# Altium schematic sheet MPPT.SchDoc
size 297 x 209 mm; SheetNumber: 6; SheetTotal: 9
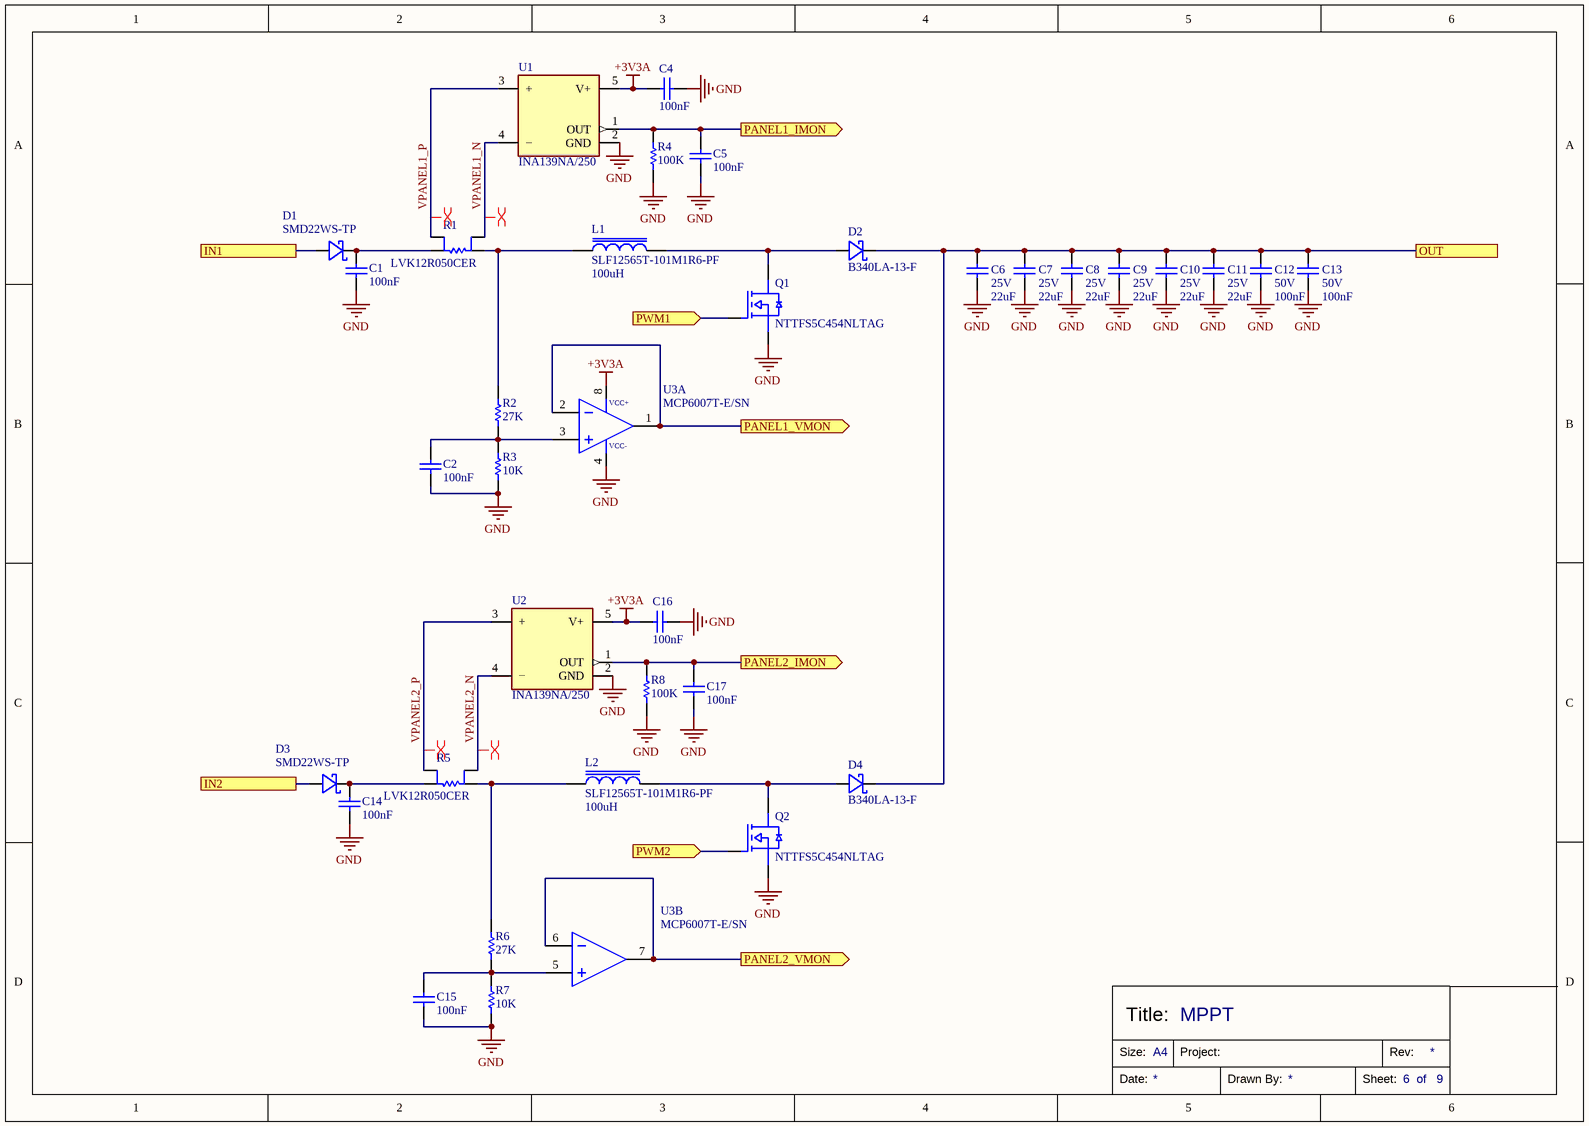
[diagram p0: MPPT.SchDoc]

## Parts
C1  Capacitance: 100nF  [CAPC0603X040]  (hidden comment: C0603C104K5RACTU)
C2  Capacitance: 100nF  [CAPC0603X040]  (hidden comment: C0603C104K5RACTU)
C4  Capacitance: 100nF  [CAPC0603X040]  (hidden comment: C0603C104K5RACTU)
C5  Capacitance: 100nF  [CAPC0603X040]  (hidden comment: C0603C104K5RACTU)
C6  Voltage Rating: 25V  Capacitance: 22uF  [CAPC1210X090]  (hidden comment: CL32B226KAJNNNE)
C7  Voltage Rating: 25V  Capacitance: 22uF  [CAPC1210X090]  (hidden comment: CL32B226KAJNNNE)
C8  Voltage Rating: 25V  Capacitance: 22uF  [CAPC1210X090]  (hidden comment: CL32B226KAJNNNE)
C9  Voltage Rating: 25V  Capacitance: 22uF  [CAPC1210X090]  (hidden comment: CL32B226KAJNNNE)
C10  Voltage Rating: 25V  Capacitance: 22uF  [CAPC1210X090]  (hidden comment: CL32B226KAJNNNE)
C11  Voltage Rating: 25V  Capacitance: 22uF  [CAPC1210X090]  (hidden comment: CL32B226KAJNNNE)
C12  Voltage Rating: 50V  Capacitance: 100nF  [CAPC0603X040]  (hidden comment: C0603C104K5RACTU)
C13  Voltage Rating: 50V  Capacitance: 100nF  [CAPC0603X040]  (hidden comment: C0603C104K5RACTU)
C14  Capacitance: 100nF  [CAPC0603X040]  (hidden comment: C0603C104K5RACTU)
C15  Capacitance: 100nF  [CAPC0603X040]  (hidden comment: C0603C104K5RACTU)
C16  Capacitance: 100nF  [CAPC0603X040]  (hidden comment: C0603C104K5RACTU)
C17  Capacitance: 100nF  [CAPC0603X040]  (hidden comment: C0603C104K5RACTU)
D1  SMD22WS-TP  [SOD-323]
D2  B340LA-13-F  [DO-214]
D3  SMD22WS-TP  [SOD-323]
D4  B340LA-13-F  [DO-214]
L1  SLF12565T-101M1R6-PF  Inductance: 100uH  [SLF12565T-101M1R6-PF]
L2  SLF12565T-101M1R6-PF  Inductance: 100uH  [SLF12565T-101M1R6-PF]
Q1  NTTFS5C454NLTAG  [NTTFS5C454NLTAG]
Q2  NTTFS5C454NLTAG  [NTTFS5C454NLTAG]
R1  LVK12R050CER  [LVK12R050CER-1]
R2  Resistance: 27K  [RESC0603]  (hidden comment: RMCF0603FT27K0)
R3  Resistance: 10K  [RESC0603]  (hidden comment: RMCF0603FT10K0)
R4  Resistance: 100K  [RESC0603]  (hidden comment: RMCF0603FT100K)
R5  LVK12R050CER  [LVK12R050CER-2]
R6  Resistance: 27K  [RESC0603]  (hidden comment: RMCF0603FT27K0)
R7  Resistance: 10K  [RESC0603]  (hidden comment: RMCF0603FT10K0)
R8  Resistance: 100K  [RESC0603]  (hidden comment: RMCF0603FT100K)
U1  INA139NA/250  [SOT23-5 IC]
U2  INA139NA/250  [SOT23-5 IC]
U3  MCP6007T-E/SN  [SOIC-8]  (parts A,B of 2)

## Ports
IN1 (see Power_Path[3C]), IN2 (see Power_Path[3C]), OUT (see Power_Path[3C], Charger[6B]), PANEL1_IMON (out, see Power_Path[3C], Controller[2B]), PANEL1_VMON (out, see Power_Path[3C], Controller[2B]), PANEL2_IMON (out, see Power_Path[3C], Controller[2B]), PANEL2_VMON (out, see Power_Path[3C], Controller[2B]), PWM1 (in, see Power_Path[3C]), PWM2 (in, see Power_Path[3C])

## Nets
+3V3A: C4.2 C16.2 U1.5(V+) U2.5(V+) U3.8(VCC+)
GND: C1.1 C2.1 C4.1 C5.1 C6.1 C7.1 C8.1 C9.1 C10.1 C11.1 C12.1 C13.1 C14.1 C15.1 C16.1 C17.1 Q1.S Q2.S R3.1 R4.1 R7.1 R8.1 U1.2(GND) U2.2(GND) U3.4(VCC-)
IN1: D1.A ; port IN1
IN2: D3.A ; port IN2
OUT: C6.2 C7.2 C8.2 C9.2 C10.2 C11.2 C12.2 C13.2 D2.K D4.K ; port OUT
PANEL1_IMON: C5.2 R4.2 U1.1(OUT) ; port PANEL1_IMON
PANEL1_VMON: U3.1(OUTA) U3.2(INA-) ; port PANEL1_VMON
PANEL2_IMON: C17.2 R8.2 U2.1(OUT) ; port PANEL2_IMON
PANEL2_VMON: U3.6(INB-) U3.7(OUTB) ; port PANEL2_VMON
PWM1: Q1.G ; port PWM1
PWM2: Q2.G ; port PWM2
VPANEL1_N: R1.3 U1.4(−)
VPANEL1_P: R1.2 U1.3(+)
VPANEL2_N: R5.3 U2.4(−)
VPANEL2_P: R5.2 U2.3(+)
NetC1_2: C1.2 D1.K R1.1
NetC2_2: C2.2 R2.1 R3.2 U3.3(INA+)
NetC14_2: C14.2 D3.K R5.1
NetC15_2: C15.2 R6.1 R7.2 U3.5(INB+)
NetD2_A: D2.A L1.1 Q1.D
NetD4_A: D4.A L2.1 Q2.D
NetL1_2: L1.2 R1.4 R2.2
NetL2_2: L2.2 R5.4 R6.2

## Layout directives
differential pair: VPANEL1_N, VPANEL1_P, VPANEL2_N, VPANEL2_P

## Notes on the sheet
- MPPT
- Size:
- Title:
- A4
- Project:
- Rev:
- Date:
- Drawn By:
- Sheet:
- of

## Library data of the parts
C1 C2 C4 C5 C12-C17 = C0603C104K5RACTU: 0.1 µF ±10% 50V Ceramic Capacitor X7R 0603 (1608 Metric); Part Number: C0603C104K5RACTU; Distributor Part Number: 399-C0603C104K5RACTUCT-ND; Tolerance: 10%; Case Code: 0603; Distributor: Digikey
  C1 C2 C4 C5 C14-C17: Voltage Rating: 50V
C6-C11 = CL32B226KAJNNNE: 22 µF ±10% 25V Ceramic Capacitor X7R 1210 (3225 Metric); Part Number: CL32B226KAJNNNE; Distributor Part Number: 1276-3392-1-ND; Tolerance: 10%; Case Code: 1210; Distributor: Digikey
D1 D3 = SMD22WS-TP: Diode Schottky 20V 2A Fast Recovery; fORWARD vOLTAGE: 550mV; Part Number: SMD22WS-TP; Distributor: Digikey; Distributor Part Number: SMD22WS-TPMSCT-ND; Operating Temperature: -55°C ~ 125°C; Voltage - DC Reverse: 20V; Current - Average: 2A
D2 D4 = B340LA-13-F: Diode Schottky 40V 3A 450mV FVf Fast Recovery; Part Number: B340LA-13-F; Distributor: Digikey; Distributor Part Number: B340LA-FDICT-ND; Operating Temperature: -55°C ~ 125°C; Voltage - DC Reverse (Max): 40V; Current - Average Rectified: 3A; Voltage - Foward: 450mV
L1 L2 = SLF12565T-101M1R6-PF: Inductor 100uH Shielded Drum Core, 1.9A 148mOhm; Saturation Current: 1.6A; Part Number: SLF12565T-101M1R6-PF; Distributor: Digikey; Distributor Part Number: 445-174227-1-ND; Operating Temperature: -20°C ~ 105°C; Current Rating: 1.9A; DC Resistance: 148mOhm
Q1 Q2 = NTTFS5C454NLTAG: N-MOSFET 40 V , 85 A, 3.8 mΩ Rds(on) @ 10 V, WDFN-8 3.3×3.3 mm, low Qg (~18 nC); Manufacturer: Onsemi; Vdss: 40V; Current - Continuous Drain (Id): 20A; Rds On (Max): 3.8mOhm; Gate Charge (Qg) (Max) @ Vgs: 18nC @ 10V; Vgs (Max): 20V; Power Dissipation (Max) (Ta): 3.2W; Part Number: NTTFS5C454NL; Distributor: Mouser; Distributor Part Number: 863-NTTFS5C454NLTAG; Operating Temperature: -55°C ~ 175°C; ComponentLink1Description: Datasheet; ComponentLink1URL: https://www.onsemi.com/pdf/datasheet/nttfs5c454nl-d.pdf
R1 R5 = LVK12R050CER: Resistor, Current Sense 50 mOhms ±0.25% 0.5W, Moisture Resistant Thick Film; Manufacturer: Ohmite; Temperature Coefficient: ±50ppm/°C; Resistance: 50mOhm; Part Number: LVK12R050CER; Distributor: Mouser; Distributor Part Number: 588-LVK12R050CER; Power: 0.5W; Tolerance: 0.25%
R2 R6 = RMCF0603FT27K0: 27 kOhms ±1% 0.1W, 1/10W Chip Resistor 0603 (1608 Metric) Automotive AEC-Q200 Thick Film; Part Number: RMCF0603FT27K0; Tolerance: 1%; Distributor: Digikey; Distributor Part Number: RMCF0603FT27K0CT-ND; Case Code: 0603
R3 R7 = RMCF0603FT10K0: 10 kOhms ±1% 0.1W, 1/10W Chip Resistor 0603 (1608 Metric) Automotive AEC-Q200 Thick Film; Part Number: RMCF0603FT10K0; Tolerance: 1%; Distributor: Digikey; Distributor Part Number: RMCF0603FT10K0CT-ND; Case Code: 0603
R4 R8 = RMCF0603FT100K: 100 kOhms ±1% 0.1W, 1/10W Chip Resistor 0603 (1608 Metric) Automotive AEC-Q200 Thick Film; Part Number: RMCF0603FT100K; Tolerance: 1%; Distributor: Digikey; Distributor Part Number: RMCF0603FT100KCT-ND; Case Code: 0603
U1 U2 = INA139NA/250: 40V Current Sense Amplifier 1 Circuit 8-MSOP; Accuracy: 0.5%; Distributor: Digikey; Distributor Part Number: INA139NA/250CT-ND; Operating Temperature: -40°C ~ 125°C; Part Number: INA139NA/250
U3 = MCP6007T-E/SN: Operational Amplifier general purpose, 2-Circuit 1.8V ~ 5.5V 1MHz; Slew Rate: 1.9V/us; Part Number: MCP6007T-E/SN; Distributor: Digikey; Distributor Part Number: 150-MCP6007T-E/SNCT-ND; Input Voltage: 1.8V ~ 5.5V; Operating Temperature: -40°C ~ 125°C; Gain Bandwidth Product: 1MHz